# EAGLE design LCD_TFT_Breakout_1in8_128x160 (EAGLE 9.1.3)
DESIGNER: Owen Lyke
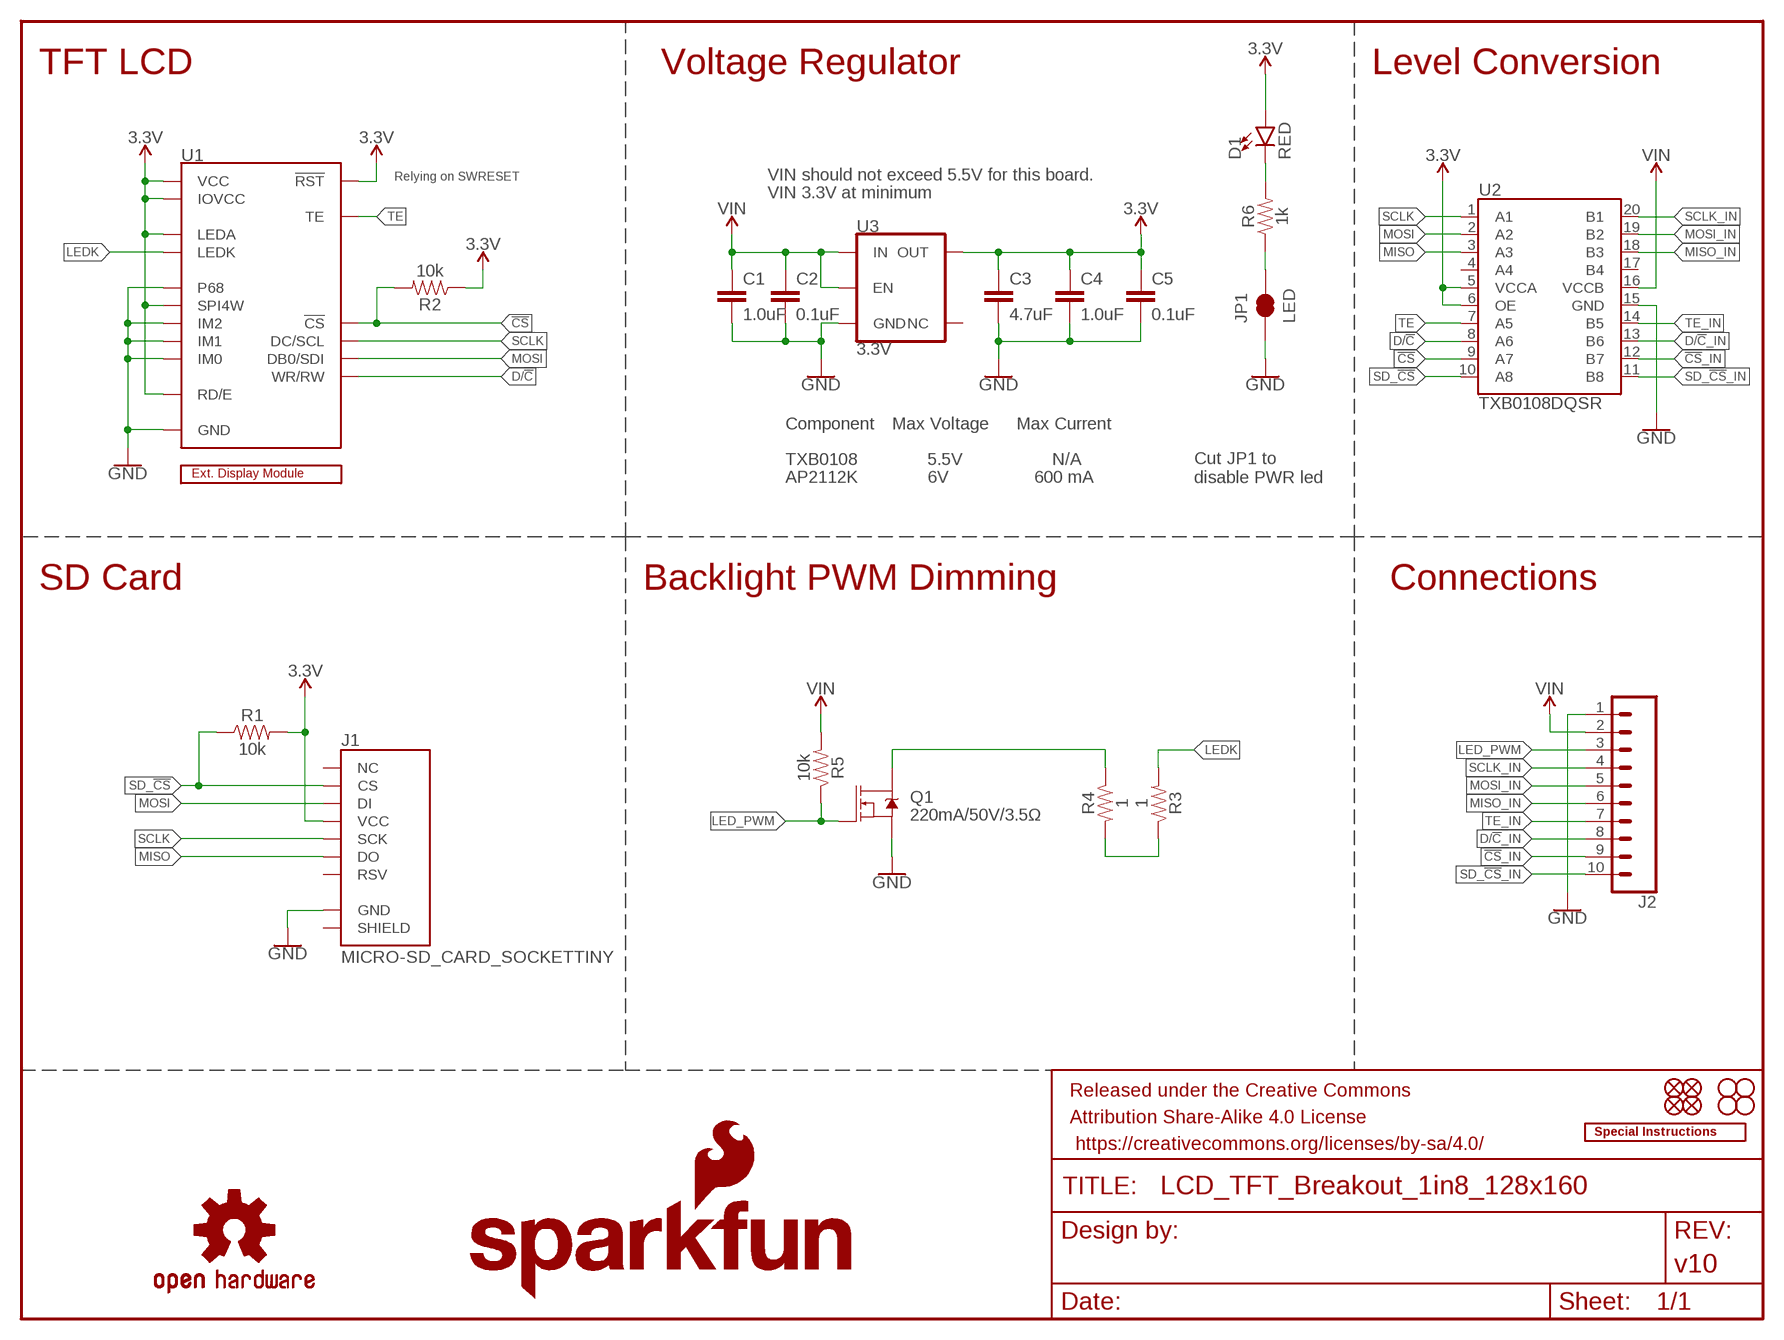
[diagram p0: schematic, sheet 1]

## Parts
C1  1.0uF  1.0UF-0603-16V-10%  [0603]
C2  0.1uF  0.1UF-0603-100V-10%  [0603]
C3  4.7uF  4.7UF-0603-6.3V-(10%)  [0603]
C4  1.0uF  1.0UF-0603-16V-10%  [0603]
C5  0.1uF  0.1UF-0603-100V-10%  [0603]
D1  RED  LED-RED0603  [LED-0603]
FD1  FIDUCIAL1X2  [FIDUCIAL-1X2]
FD2  FIDUCIAL1X2  [FIDUCIAL-1X2]
FD3  FIDUCIAL1X2  [FIDUCIAL-1X2]
FD4  FIDUCIAL1X2  [FIDUCIAL-1X2]
FRAME1  FRAME-LETTER  [CREATIVE_COMMONS]
H1  STAND-OFF  [STAND-OFF]
H2  STAND-OFF  [STAND-OFF]
H3  STAND-OFF  [STAND-OFF]
H4  STAND-OFF  [STAND-OFF]
J1  MICRO-SD_CARD_SOCKETTINY  [MICROSD_TINY]
J2  CONN_10NO_SILK_PTH_FEMALE  [1X10_NO_SILK]
JP1  LED  JUMPER-SMT_2_NC_TRACE_SILK  [SMT-JUMPER_2_NC_TRACE_SILK]
LOGO1  SFE_LOGO_NAME_FLAME.3_INCH  [SFE_LOGO_NAME_FLAME_.3]
LOGO2  SPECIAL_INSTRUCTIONS-PRODUCTION  [PRODUCTION_INSTRUCTIONS]
LOGO3  OSHW-LOGOS  [OSHW-LOGO-S]
Q1  220mA/50V/3.5Ω  MOSFET-NCH-BSS138  [SOT23-3]
R1  10k  10KOHM-0603-1/10W-1%  [0603]
R2  10k  10KOHM-0603-1/10W-1%  [0603]
R3  1  1OHM-0603-1/10W-1%  [0603]
R4  1  1OHM-0603-1/10W-1%  [0603]
R5  10k  10KOHM-0603-1/10W-1%  [0603]
R6  1k  1KOHM-0603-1/10W-1%  [0603]
U1  KWH018ST14-F01_4WSPI-BOTTOM  [FPC05040-17204]
U2  TXB0108DQSR  TXB0108  [UFDFN-20]
U3  3.3V  V_REG_AP2112K-3.3V  [SOT23-5]
U$33  EXTERNAL_DISP-KWH018ST14-F01  [KWH018ST14-F01_HOLES]

## Nets
3.3V: C3.1 C4.1 C5.1 D1.A J1.4(VCC) R1.2 R2.1 U1.P$1(LEDA) U1.P$4(!RST) U1.P$5(VCC) U1.P$6(IOVCC) U1.P$26(RD/E) U1.P$30(SPI4W) U2.5(VCCA) U2.6(OE) U3.5(OUT)
!CS: R2.2 U1.P$29(!CS) U2.9(A7)
!CS!_IN: J2.9 U2.12(B7)
D/!C: U1.P$27(WR/RW) U2.8(A6)
D/!C!_IN: J2.8 U2.13(B6)
GND: C1.2 C2.2 C3.2 C4.2 C5.2 J1.6(GND) J2.1 JP1.1 Q1.2(S) U1.P$3(GND) U1.P$8(GND) U1.P$9(GND) U1.P$10(GND) U1.P$11(GND) U1.P$12(GND) U1.P$13(GND) U1.P$14(GND) U1.P$15(GND) U1.P$16(GND) U1.P$17(GND) U1.P$18(GND) U1.P$19(GND) U1.P$20(GND) U1.P$21(GND) U1.P$22(GND) U1.P$23(GND) U1.P$24(GND) U1.P$31(P68) U1.P$32(IM2) U1.P$33(IM1) U1.P$34(IM0) U1.P$35(GND) U1.P$40(GND) U2.15(GND) U3.2(GND)
LED_PWM: J2.3 Q1.1(G) R5.1
LEDK: R3.2 U1.P$2(LEDK)
MISO: J1.7(DO) U2.3(A3)
MISO_IN: J2.6 U2.18(B3)
MOSI: J1.3(DI) U1.P$25(DB0/SDI) U2.2(A2)
MOSI_IN: J2.5 U2.19(B2)
N$1: D1.C R6.2
N$2: JP1.2 R6.1
N$3: R3.1 R4.2
N$5: Q1.3(D) R4.1
SCLK: J1.5(SCK) U1.P$28(DC/SCL) U2.1(A1)
SCLK_IN: J2.4 U2.20(B1)
SD_!CS: J1.2(CS) R1.1 U2.10(A8)
SD_!CS!_IN: J2.10 U2.11(B8)
TE: U1.P$7(TE) U2.7(A5)
TE_IN: J2.7 U2.14(B5)
VIN: C1.1 C2.1 J2.2 R5.2 U2.16(VCCB) U3.1(IN) U3.3(EN)
Unconnected: J1.1(RSV) J1.8(RSV) J1.9(NC) J1.GND1(SHIELD) J1.GND2(SHIELD) J1.GND3(SHIELD) J1.GND4(SHIELD) J1.GND5(SHIELD) J1.GND6(SHIELD) U2.4(A4) U2.17(B4) U3.4(NC)

## Notes on the sheet
- TFT LCD | Voltage Regulator | Level Conversion
- Relying on SWRESET | VIN should not exceed 5.5V for this board.
- VIN 3.3V at minimum
- Component | Max Voltage | Max Current
- TXB0108 | 5.5V | N/A
- AP2112K | 6V | 600 mA
- Cut JP1 to 
  disable PWR led
- SD Card | Backlight PWM Dimming | Connections

## Library data of the parts
C1 C4 = SparkFun-Capacitors:1.0UF: 1µF ceramic capacitors A capacitor is a passive two-terminal electrical component used to store electrical energy temporarily in an electric field.; PROD_ID: CAP-00868
C2 C5 = SparkFun-Capacitors:0.1UF: 0.1µF ceramic capacitors A capacitor is a passive two-terminal electrical component used to store electrical energy temporarily in an electric field.; PROD_ID: CAP-08390
C3 = SparkFun-Capacitors:4.7UF: 4.7µF ceramic capacitors A capacitor is a passive two-terminal electrical component used to store electrical energy temporarily in an electric field.; PROD_ID: CAP-08280
D1 = SparkFun-LED:LED-RED: Red SMD LED Used in manufacturing of most products at SparkFun Packages: 0603 - SMD 0603 package [Product Link] <http://docs.avagotech.com/docs/AV02-0551EN> 0603 SMART - SMD 0603 SMART package ( more efficient and expensive)[Product Link] <http://www.osram-os.com/Graphics/XPic2/00077099_0.pdf> 1206 - SMD1206 package [Product Link] <https://www.sparkfun.com/datasheets/DevTools/LilyPad/Q150OVS4.pdff> SparkFun Products: Pro Mini 328 -5V <https://www.sparkfun.com/products/821> RedBoard <https://www.sparkfun.com/products/12757> IOIO-OTG <https://www.sparkfun.com/products/13613>; PROD_ID: DIO-00819
FD1-FD4 = SparkFun-Aesthetics:FIDUCIAL: Fiducial Alignment Points Point-of-reference for pick-and-place machines and other optical instruments.
FRAME1 = SparkFun-Aesthetics:FRAME-LETTER: Schematic Frame - Letter Standard 8.5x11 US Letter frame; DESIGNER: Owen Lyke; REV: v10
H1-H4 = SparkFun-Hardware:STAND-OFF: Stand Off Drill holes for mechanically mounting via screws, standoffs, etc. Note: Use the keepout ring to avoid running the screw head into surrounding components. Variant Overviews STAND-OFF - Mechanical footprint for a #4 phillips button head screw. STAND-OFF-TIGHT - Mechanical footprint for a #4 phillips button head screw, Example SparkFun Products Screw - Phillips Head (1/4", 4-40, 10 pack) <https://www.sparkfun.com/products/10453> (PRT-10453) Screw - Phillips Head (1/2", 4-40, 10 pack) <https://www.sparkfun.com/products/10452> (PRT-10452) Screw - Phillips Head (3/4", 4-40, 10 pack) <https://www.sparkfun.com/products/10451> (PRT-10451) Screw - Phillips Head (1", 4-40, 10 pack) <https://www.sparkfun.com/products/10450> (PRT-10450)
J1 = SparkFun-Connectors:MICRO-SD_CARD_SOCKET: microSD Socket for Transflash Push-push type µSD socket. tDoc lines correctly indicate media card edge positions when inserting (unlocked, locked, depressed). NOTE: CD1 and CD2 are connected internally, and the default detect state of the socket is detect pin to ground. SparkFun Products: WAV Trigger <https://www.sparkfun.com/products/13660> CAN-Bus Shield <https://www.sparkfun.com/products/13262> SparkFun Level Shifing microSD Breakout <https://www.sparkfun.com/products/13743>; PROD_ID: CONN-13500
J2 = SparkFun-Connectors:CONN_10: Multi connection point. Often used as Generic Header-pin footprint for 0.1 inch spaced/style header connections On any of the 0.1 inch spaced packages, you can populate with these: Break Away Headers - Straight <https://www.sparkfun.com/products/116> (PRT-00116) Break Away Male Headers - Right Angle <https://www.sparkfun.com/products/553> (PRT-00553) Female Headers <https://www.sparkfun.com/products/115> (PRT-00115) Break Away Headers - Machine Pin <https://www.sparkfun.com/products/117> (PRT-00117) Break Away Female Headers - Swiss Machine Pin <https://www.sparkfun.com/products/743> (PRT-00743) Arduino Stackable Header - 10 Pin <https://www.sparkfun.com/products/11376> (PRT-11376) For SCREWTERMINALS and SPRING TERMINALS visit here: Screw Terimnals on SparkFun.com <https://www.sparkfun.com/search/results?term=Screw+Terminals> (5mm/3.5mm/2.54mm spacing) This device is also useful as a general connection point to wire up your design to another part of your project. Our various solder wires solder well into these plated through hole pads. Hook-Up Wire - Assortment (Stranded, 22 AWG) <https://www.sparkfun.com/products/11375> (PRT-11375) Hook-Up Wire - Assortment (Solid Core, 22 AWG) <https://www.sparkfun.com/products/11367> (PRT-11367) View the entire wire category on our website here <https://www.sparkfun.com/categories/141> Special notes: Molex polarized connector foot print use with SKU : PRT-08231 with associated crimp pins and housings. 1MM SMD Version SKU: PRT-10208 NOTES ON THE VARIANTS LOCK and LOCK_LONGPADS... This footprint was designed to help hold the alignment of a through-hole component (i.e. 6-pin header) while soldering it into place. You may notice that each hole has been shifted either up or down by 0.005 of an inch from it's more standard position (which is a perfectly straight line). This slight alteration caused the pins (the squares in the middle) to touch the edges of the holes. Because they are alternating, it causes a "brace" to hold the component in place. 0.005 has proven to be the perfect amount of "off-center" position when using our standard breakaway headers. Although looks a little odd when you look at the bare footprint, once you have a header in there, the alteration is very hard to notice. Also,if you push a header all the way into place, it is covered up entirely on the bottom side.; PROD_ID: CONN-11563
JP1 = SparkFun-Jumpers:JUMPER-SMT_2_NC_TRACE: Normally closed trace jumper This jumper has a trace between two pads so it's normally closed (NC). Use a razor knife to open the connection. For best results follow the IPC guidelines for cutting traces: Cutout at least 0.063 mm (0.005 in). Remove all loose material to clean up the cut area. Seal the cut with an approved epoxy. Reapply solder to reclose the connection.
LOGO1 = SparkFun-Aesthetics:SFE_LOGO_NAME_FLAME: SparkFun Font Logo w/ Flame This is the SparkFun full logo. The logo on the schematic will always be the same size; the package variant is the height of the flame part of the logo. Default layer for the logo on the board is tSilk.
LOGO2 = SparkFun-Aesthetics:SPECIAL_INSTRUCTIONS: Special Ordering/Production Instructions Alert Symbol for special PCB ordering instructions or unique production process warnings. Ordering Instructions Production Instructions Types of information that should be added to box: Copper weight Soldermask color Silk color PCB thickness Number of layers PCB Standard: 1.6mm FR4 1 oz copper immersion silver plating red soldermask white silkscreen Types of information that should be added to box: Special wash requirements Depaneling instructions Humidification Glue curing Default text settings: 0.07 inch 9% ratio 50% line distance
LOGO3 = SparkFun-Aesthetics:OSHW-LOGO: Open-Source Hardware (OSHW) Logo This logo indicates the piece of hardware it is found on incorporates a OSHW license and/or adheres to the definition of open source hardware found here: http://freedomdefined.org/OSHW
Q1 = SparkFun-DiscreteSemi:MOSFET-NCH: N-channel MOSFETs Voltage controlled devices that allow control of high current outputs. SparkFun Products: SparkFun OpenScale <https://www.sparkfun.com/products/13261> SparkFun Digital Sandbox <https://www.sparkfun.com/products/12651> SparkFun Monster Moto Shield <https://www.sparkfun.com/products/10182> SparkFun MOSFET Power Controller <https://www.sparkfun.com/products/11214>; PROD_ID: TRANS-00830
R1 R2 R5 = SparkFun-Resistors:10KOHM: 10kΩ resistor A resistor is a passive two-terminal electrical component that implements electrical resistance as a circuit element. Resistors act to reduce current flow, and, at the same time, act to lower voltage levels within circuits. - Wikipedia; PROD_ID: RES-00824
R3 R4 = SparkFun-Resistors:1OHM: 1Ω resistor A resistor is a passive two-terminal electrical component that implements electrical resistance as a circuit element. Resistors act to reduce current flow, and, at the same time, act to lower voltage levels within circuits. - Wikipedia; PROD_ID: RES-08269
R6 = SparkFun-Resistors:1KOHM: 1kΩ resistor A resistor is a passive two-terminal electrical component that implements electrical resistance as a circuit element. Resistors act to reduce current flow, and, at the same time, act to lower voltage levels within circuits. - Wikipedia; PROD_ID: RES-07856
U1 = SparkFun-Displays:KWH018ST14-F01_4WSPI: Fomike KWH018ST14-F01 TFT LCD Module Using 4WSPI Interface 128 x 160 pixel 18-bit color depth LCD module with LED backlight. This part uses the 4WSPI interface, though several other interface options are broken out in the FPC cable. Use the other corresponding devices for 3WSPI, and 8/9/16/18 bit parallel. Note: PROD_ID corresponds to the connector and the second ID (PROD_ID1 = LCD-14196) corresponds to the actual module Variants: Bottom - For use with bottom-contact FPC connectors Top - For use with top-contact FPC connectors SparkFun Products:; PROD_ID: CONN-14082; PROD_ID1: LCD-14196
U2 = SparkFun-IC-Comms:TXB0108: 8-Bit Bi-Directional Level Shifter 1.2V-3.6V (VCCA) to 1.65V-5.5V (VCCB) bi-directional level shifter with auto direction sensing. Max data rate - VCCA 1.2V: 20Mbps (50ns), VCCA 3.3V: 100Mbps (10ns) Digikey: 296-27217-1-ND (20-UFDFN) SparkFun Products SparkFun GPS Logger Shield <https://www.sparkfun.com/products/13750> (GPS-13750) SparkFun Block for Intel® Edison - microSD <https://www.sparkfun.com/products/13041> (DEV-13041) SparkFun Block for Intel® Edison - Dual H-Bridge <https://www.sparkfun.com/products/13043> (DEV-13043) SparkFun Block for Intel® Edison - GPIO <https://www.sparkfun.com/products/13038> (DEV-13038) SparkFun Block for Intel® Edison - Raspberry Pi B <https://www.sparkfun.com/products/13044> (DEV-13044); PROD_ID: IC-12292
U3 = SparkFun-IC-Power:V_REG_AP2112: AP2112 - 600mA CMOS LDO Regulator w/ Enable The AP2112 is CMOS process low dropout linear regulator with enable function, the regulator delivers a guaranteed 600mA (min.) continuous load current. Features Output Voltage Accuracy: ±1.5% Output Current: 600mA (Min.) Foldback Short Current Protection: 50mA Enable Function to Turn ON/OFF VOUT Low Dropout Voltage (3.3V): 250mV (Typ.) @IOUT=600mA Excellent Load Regulation: 0.2%/A (Typ.) Excellent Line Regulation: 0.02%/V (Typ.) Low Quiescent Current: 55μA (Typ.) Low Standby Current: 0.01μA (Typ.) Low Output Noise: 50μVRMS PSRR: 100Hz -65dB, 1kHz -65dB OTSD Protection Stable with 1.0μF Flexible Cap: Ceramic, Tantalum and Aluminum Electrolytic Operation Temperature Range: -40°C to 85°C ESD: MM 400V, HBM 4000V; PROD_ID: VREG-12457
U$33 = SparkFun-Displays:EXTERNAL_DISP: External Display Device Use this device to represent a display module that you connect to your board with a connector. (The connector will be electrically linked to the symbol for your display and connected to traces) Using this along with a footprint of the display module outline will allow the BOM utility to find the correct PROD_ID for the module. Then you can move it to the BOM list (it will be in non-BOM list unless it has a hardware element like holes or pads) Variants: KWH018ST14-F01A footprint of the KWH018ST14-F01 with holes SparkFun Products:; PROD_ID: LCD-14196

## Board
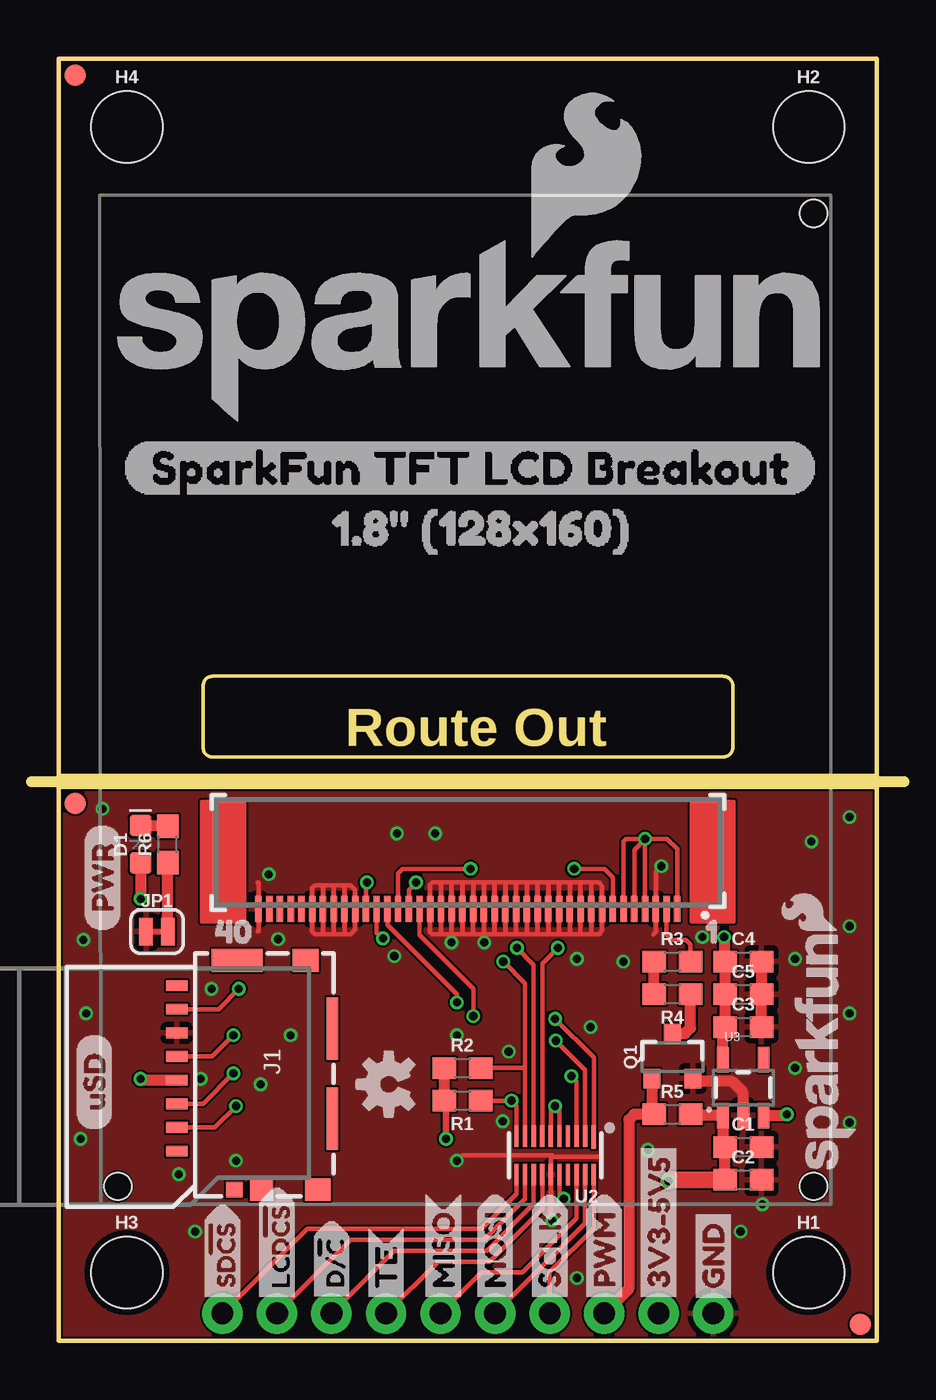
[diagram p1: board, top side]
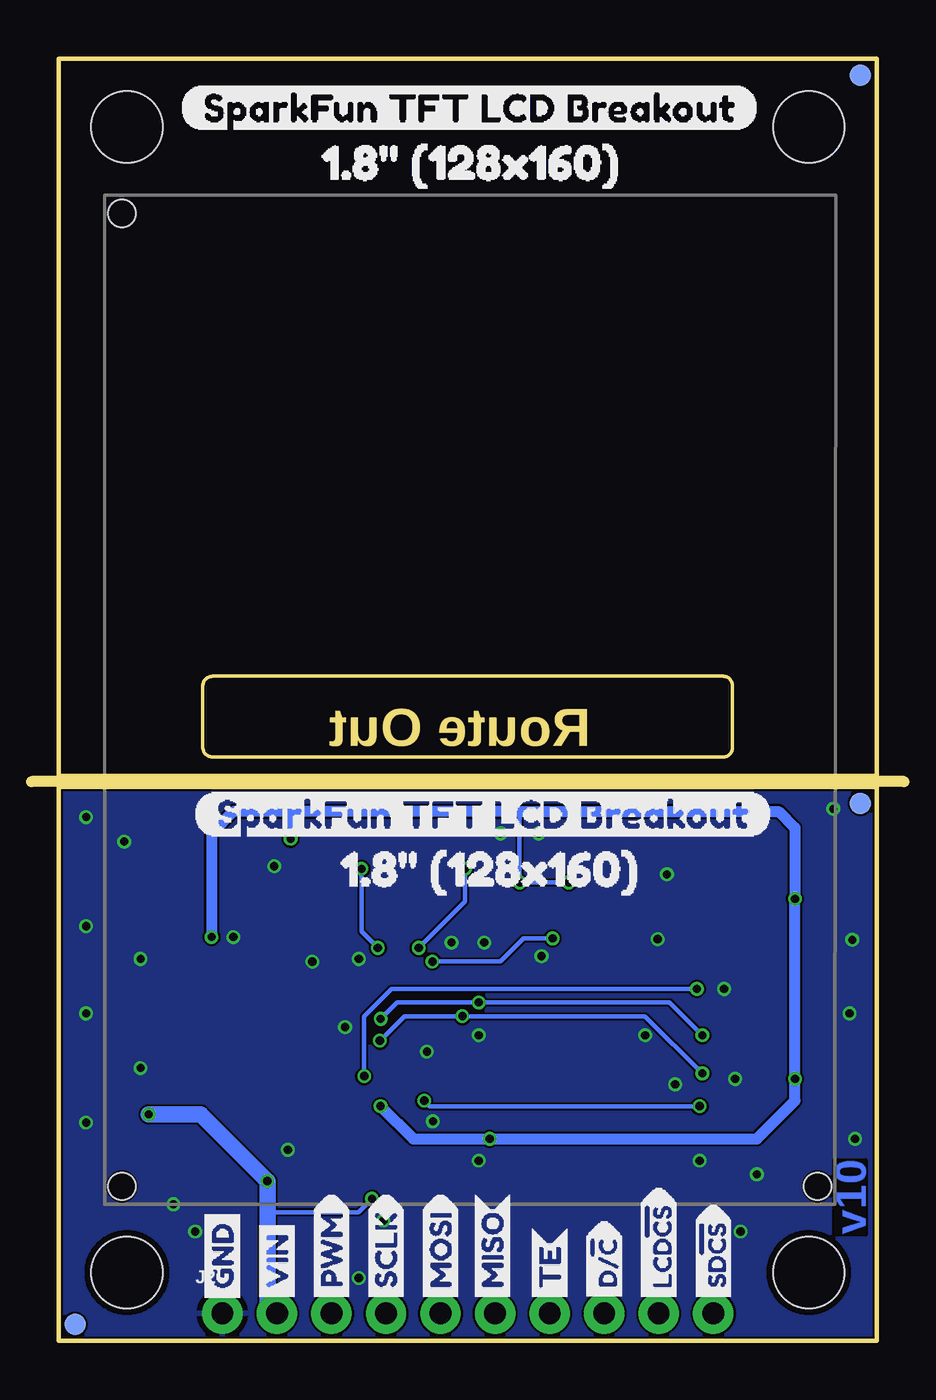
[diagram p2: board, bottom side, seen from below]

Size 38.1 x 59.69 mm. Coordinates in mm from the lower left corner, seen from the top.
Outline: 38.1,0 0,0 0,25.78 38.1,25.78 38.1,0
Outline: 0,59.69 38.1,59.69 38.1,26.29 0,26.29 0,59.69
Outline: 30.94,30.94 arc-90 31.4,30.48 31.4,27.65 arc-90 30.93,27.18 7.15,27.18 arc-90 6.73,27.6 6.73,30.51 arc-90 7.16,30.94 30.94,30.94
Copper layers (1*16): Top 0.035mm / dielectric 1.5mm / Bottom 0.035mm
Design rules "SparkFun-2-layer-FAB-LIMIT": minimum track width 4mil, minimum drill 6mil, track to track 4mil, track to pad 4mil, pad to pad 4mil, via to via 4mil, smd to smd 4mil, copper to edge 4mil, drill to drill 4mil, minimum pad ring 5mil, minimum via ring 5mil, stop-mask expansion 4mil, vias tented up to drill 25mil, thermal gap 10mil
Milling: 1 lines

### Footprints (pad centres in the part's own frame; a part is rotated, then mirrored left to right if it is on the bottom)
0603 = smd 1.1 x 1: 1 -0.85,0; 2 0.85,0
LED-0603 = smd 1 x 1: A -0.877,0; C 0.877,0
FIDUCIAL-1X2 = smd 1 x 1: 1 0,0
STAND-OFF = hole 3.302: 0,0
MICROSD_TINY = smd 0.5 x 1: 1 9.2,-0.85; 2 8.1,-0.85; 3 7,-0.85; 4 5.9,-0.85; 5 4.8,-0.85; 6 3.7,-0.85; 7 2.6,-0.85; 8 1.5,-0.85 | smd 0.72 x 0.78: 9 11,1.83 | smd 1.05 x 1.08: GND1 11,3.1 | smd 1.05 x 1.2: GND2 11,5.71; GND3 0.325,5.14 | smd 1.05 x 2.39: GND4 0.325,1.955 | smd 2.91 x 0.55: GND5 3.505,6.385; GND6 7.695,6.385
1X10_NO_SILK = drill 1.016 pad 1.88: 1 0,0; 2 2.54,0; 3 5.08,0; 4 7.62,0; 5 10.16,0; 6 12.7,0; 7 15.24,0; 8 17.78,0; 9 20.32,0; 10 22.86,0
SMT-JUMPER_2_NC_TRACE_SILK = smd 0.635 x 1.27: 1 -0.508,0; 2 0.508,0
SOT23-3 = smd 0.8 x 0.9: 1 -0.95,-1; 2 0.95,-1; 3 0,1.1
FPC05040-17204 = smd 0.3 x 1.2: P$1 -9.75,0.6; P$2 -9.25,0.6; P$3 -8.75,0.6; P$4 -8.25,0.6; P$5 -7.75,0.6; P$6 -7.25,0.6; P$7 -6.75,0.6; P$8 -6.25,0.6; P$9 -5.75,0.6; P$10 -5.25,0.6; P$11 -4.75,0.6; P$12 -4.25,0.6; P$13 -3.75,0.6; P$14 -3.25,0.6; P$15 -2.75,0.6; P$16 -2.25,0.6; P$17 -1.75,0.6; P$18 -1.25,0.6; P$19 -0.75,0.6; P$20 -0.25,0.6; P$21 0.25,0.6; P$22 0.75,0.6; P$23 1.25,0.6; P$24 1.75,0.6; P$25 2.25,0.6; P$26 2.75,0.6; P$27 3.25,0.6; P$28 3.75,0.6; P$29 4.25,0.6; P$30 4.75,0.6; P$31 5.25,0.6; P$32 5.75,0.6; P$33 6.25,0.6; P$34 6.75,0.6; P$35 7.25,0.6; P$36 7.75,0.6; P$37 8.25,0.6; P$38 8.75,0.6; P$39 9.25,0.6; P$40 9.75,0.6
UFDFN-20 = smd 0.2 x 1.1: 1 -1.8,-0.85 | smd 0.2 x 1: 2 -1.4,-0.9; 3 -1,-0.9; 4 -0.6,-0.9; 5 -0.2,-0.9; 6 0.2,-0.9; 7 0.6,-0.9; 8 1,-0.9; 9 1.4,-0.9; 10 1.8,-0.9; 11 1.8,0.9; 12 1.4,0.9; 13 1,0.9; 14 0.6,0.9; 15 0.2,0.9; 16 -0.2,0.9; 17 -0.6,0.9; 18 -1,0.9; 19 -1.4,0.9; 20 -1.8,0.9
SOT23-5 = smd 0.55 x 1.2: 1 -0.95,-1.3; 2 0,-1.3; 3 0.95,-1.3; 4 0.95,1.3; 5 -0.95,1.3
KWH018ST14-F01_HOLES = hole 1.27: -33.25,-0.85; -33.25,-46.15; -0.85,-46.15

### Placement (x,y rotation side)
C1  31.88,9.02 0 top
C2  31.88,7.49 0 top
C3  31.88,14.61 0 top
C4  31.88,17.65 0 top
C5  31.88,16.13 0 top
D1  3.81,23.11 90 top
FD1  0.76,58.93 0 top
FD2  37.34,0.76 0 top
FD3  0.76,58.93 0 bottom
FD4  37.34,0.76 0 bottom
FD5  FIDUCIAL1X2  [FIDUCIAL-1X2]  0.76,25.02 0 top
FD6  FIDUCIAL1X2  [FIDUCIAL-1X2]  0.76,25.02 0 bottom
FRAME1  0,-23.11 0 top  (outside the outline)
H1  34.92,3.17 0 top
H2  34.92,56.52 0 top
H3  3.17,3.17 0 top
H4  3.17,56.52 0 top
J1  6.35,18.03 270 top
J2  30.48,1.27 0 bottom
JP1  4.57,19.05 0 top
LOGO1  19.05,46.99 0 top
LOGO2  -24.51,-40.39 0 top  (outside the outline)
LOGO3  15.37,11.94 90 top
Q1  28.57,13.21 0 top
R1  18.8,11.18 180 top
R2  18.8,12.7 0 top
R3  28.57,17.65 0 top
R4  28.57,16.13 180 top
R5  28.57,10.54 0 top
R6  5.08,23.11 90 top
U1  19.05,20.7 180 top
U2  23.11,8.64 180 top
U3  31.88,11.79 0 top
U$1  [3V3#5V50]  27.94,1.52 90 top
U$2  [SFE_LOGO_NAME_.1]  35.69,13.46 90 top
U$3  [SFE_LOGO_FLAME_.1]  34.92,19.94 90 top
U$4  [USD2]  1.65,9.78 90 top
U$5  [LCD#CS1]  10.16,1.4 90 top
U$6  [LCD#CS1]  10.16,1.4 90 bottom
U$7  [D##C7]  12.7,1.4 90 bottom
U$8  [SD#CS0]  7.62,1.4 90 top
U$9  [GND0]  30.48,1.52 90 bottom
U$10  [VIN1]  27.94,1.52 90 bottom
U$11  [MISO3]  17.91,1.52 90 bottom
U$12  [MOSI2]  20.32,1.52 90 bottom
U$13  [SCLK4]  22.86,1.52 90 bottom
U$14  [TE5]  15.24,1.52 90 bottom
U$15  [PWM6]  25.4,1.52 90 bottom
U$16  [SD#CS0]  7.62,1.4 90 bottom
U$17  [10]  29.21,19.05 0 top
U$18  [PWR4]  2.03,19.05 90 top
U$19  [SPARKFUN_TFT_LCD_BREAKOUT1]  2.92,40.64 0 top
U$20  [1#8#_#128X160#1]  11.4,37.85 0 top
U$21  [SPARKFUN_TFT_LCD_BREAKOUT2]  32.51,57.4 0 bottom
U$22  [1#8#_#128X160#0]  27.18,54.86 0 bottom
U$23  [SPARKFUN_TFT_LCD_BREAKOUT2]  31.88,24.51 0 bottom
U$24  [1#8#_#128X160#0]  26.29,21.97 0 bottom
U$25  [D##C7]  12.7,1.4 90 top
U$26  [MISO3]  17.91,1.52 90 top
U$27  [MOSI2]  20.32,1.52 90 top
U$28  [SCLK4]  22.86,1.52 90 top
U$29  [TE5]  15.24,1.52 90 top
U$30  [PWM6]  25.4,1.52 90 top
U$31  [401]  6.35,19.05 0 top
U$32  [GND0]  30.48,1.52 90 top
U$33  1.91,53.34 0 bottom

### Tracks (layer width: path | path; a pad name or v marks a point on that pad's centre or on a via)
3.3V  (via drill 0.38)
  Top 0.203: U2.6 22.91,10.72 v23.11,10.92 23.31,10.72 U2.5 | U1.P$4 v27.3,23.36 | v27.3,23.36 v27.3,23.37 | U1.P$5 26.8,22.86 v27.3,23.36 | U1.P$6 26.3,23.25 26.42,23.37 v27.3,23.37 v27.3,23.36 | U1.P$1 28.8,22.89 28.33,23.36 v27.3,23.36 | U1.P$26 16.3,21 v16.64,21.34 | U1.P$30 14.3,21.29 v14.35,21.34
  Top 0.305: v18.03,9.4 18.03,11.09 R1.2
  Top 0.508: U3.5 30.93,14.51 C3.1 C5.1 C4.1 30.99,17.69 v30.99,18.8 | R2.1 R1.2 | D1.A v3.81,20.57 | J1.4 3.87,12.13 v3.81,12.19
  Bottom 0.203: 16.64,24.64 v16.64,21.34 v14.35,21.34
  Bottom 0.508: v23.11,10.92 21.59,9.4 v18.03,9.4 5.59,9.4 3.81,11.18 v3.81,12.19 v3.81,20.57 3.81,23.88 4.57,24.64 16.64,24.64 27.3,24.64 | 27.3,24.64 29.97,24.64 30.99,23.62 v30.99,18.8 | v27.3,23.37 27.3,24.64
!CS  (via drill 0.38)
  Top 0.203: U1.P$29 14.8,18.99 15.06,18.73 v15.1,18.73 | U2.9 21.71,12.7 | 21.71,12.7 21.71,16.64 v20.7,17.65 | R2.2 21.71,12.7
  Bottom 0.203: v20.7,17.65 17.53,17.65 16.45,18.73 v15.1,18.73
!CS!_IN
  Top 0.203: U2.12 21.71,6.6 19.81,4.7 13.59,4.7 J2.9
D/!C  (via drill 0.38)
  Top 0.203: U2.8 22.11,17.51 v21.34,18.29 | v19.18,21.97 16,21.97 15.8,21.77 U1.P$27
  Bottom 0.203: v19.18,21.97 19.18,20.45 v21.34,18.29
D/!C!_IN
  Top 0.203: J2.8 15.62,4.19 19.94,4.19 22.11,6.37 U2.13
GND  (via drill 0.38)
  Top 0.203: 9.27,21.34 9.3,21.31 U1.P$40 9.3,19.08 9.27,19.05 | 12.32,21.21 11.94,21.21 11.8,21.07 U1.P$35 11.8,19.06 11.94,18.92 12.32,18.92 | 12.32,21.21 12.83,21.21 | 12.83,21.21 13.21,21.21 | 13.21,21.21 13.59,21.21 13.8,21 U1.P$31 13.8,19.13 13.59,18.92 13.34,18.92 | 12.32,21.21 12.3,21.19 U1.P$34 12.3,18.94 12.32,18.92 | v22.99,5.59 22.91,5.66 U2.15 22.91,8.56 | 22.91,8.56 22.99,8.64 18.8,8.64 v18.54,8.38 | 22.91,8.56 25.2,8.56 25.27,8.64 | 12.32,18.92 12.83,18.92 | 12.83,18.92 13.34,18.92 | 17.78,21.34 17.4,21.34 17.3,21.24 U1.P$24 17.3,19.02 17.4,18.92 17.78,18.92 | 17.78,21.34 18.29,21.34 | 18.29,21.34 18.8,21.34 | 18.8,21.34 19.3,21.34 | 19.3,21.34 19.81,21.34 | 19.81,21.34 20.32,21.34 | 20.32,21.34 20.83,21.34 | 20.83,21.34 21.21,21.34 | 21.21,21.34 21.84,21.34 | 21.84,21.34 22.23,21.34 | 22.23,21.34 22.73,21.34 | 22.73,21.34 23.24,21.34 | 23.24,21.34 23.75,21.34 | 23.75,21.34 24.26,21.34 | 24.26,21.34 24.77,21.34 | 24.77,21.34 25.15,21.34 25.3,21.18 U1.P$8 25.3,19.08 25.15,18.92 24.77,18.92 | 17.78,18.92 18.29,18.92 | 18.29,18.92 18.8,18.92 | 18.8,18.92 19.3,18.92 | 19.3,18.92 19.81,18.92 | 19.81,18.92 20.32,18.92 | 20.32,18.92 20.83,18.92 | 20.83,18.92 21.34,18.92 | 21.34,18.92 21.84,18.92 | 21.84,18.92 22.35,18.92 | 22.35,18.92 22.86,18.92 | 22.86,18.92 23.37,18.92 | 23.37,18.92 23.88,18.92 | 23.88,18.92 24.26,18.92 | 24.26,18.92 24.77,18.92 | 24.77,18.92 24.8,18.96 U1.P$9 24.8,21.3 24.77,21.34 | 24.26,21.34 24.3,21.29 U1.P$10 24.3,18.97 24.26,18.92 | 23.75,21.34 23.8,21.29 U1.P$11 23.8,19 23.88,18.92 | 23.24,21.34 23.3,21.28 U1.P$12 23.3,18.99 23.37,18.92 | 22.73,21.34 22.8,21.27 U1.P$13 22.8,18.98 22.86,18.92
  Top 0.203: 22.23,21.34 22.3,21.26 U1.P$14 22.3,18.98 22.35,18.92 | 21.84,21.34 21.8,21.29 U1.P$15 21.8,18.97 21.84,18.92 | 21.21,21.34 21.3,21.25 U1.P$16 21.3,18.96 21.34,18.92 | 20.83,21.34 20.8,21.31 U1.P$17 20.8,18.95 20.83,18.92 | 20.32,21.34 20.3,21.32 U1.P$18 20.3,18.94 20.32,18.92 | 19.81,21.34 19.8,21.32 U1.P$19 19.8,18.93 19.81,18.92 | 19.3,21.34 U1.P$20 19.3,18.93 19.3,18.92 | 18.8,21.34 18.8,21.33 U1.P$21 18.8,18.93 18.8,18.92 | 18.29,21.34 18.3,21.32 U1.P$22 18.3,18.93 18.29,18.92 | 17.78,21.34 17.8,21.32 U1.P$23 17.8,18.94 17.78,18.92 | 27.69,18.92 27.8,19.04 U1.P$3 27.8,21.83 v28.07,22.1 | 13.21,21.21 13.3,21.12 U1.P$32 13.3,18.96 13.34,18.92 | 12.83,18.92 12.8,18.95 U1.P$33 12.8,21.18 12.83,21.21
  Top 0.508: U3.2 31.88,11.56 31.37,12.06 29.67,12.06 Q1.2 | C3.2 C5.2 C4.2
  other vias: 2.03,24.77 1.14,18.67 1.27,15.24 1.02,9.4 6.35,5.08 8.26,8.38 35.05,23.24 36.83,24.38 36.83,19.3 34.29,17.78 36.83,15.24 36.83,10.16 34.29,12.7 31.75,5.08 24.13,17.78 18.29,18.54 19.81,18.54 15.62,17.91 24.13,2.92 27.43,8.89 17.53,23.62 15.75,23.62 32.77,6.35 10.79,14.22 18.54,14.22 9.78,21.72 26.29,17.65 7.11,16.38 29.97,18.8 10.21,18.69 5.59,7.75 24.77,14.61 9.4,11.94 20.95,13.46 20.68,10.21 6.6,12.19
  pour Top (isolate 0.025): 0,0 38.1,0 38.1,26.29 0,26.29
  pour Bottom (isolate 0.025): 0,0 0,26.29 38.1,26.29 38.1,0
LED_PWM
  Top 0.508: Q1.1 27.62,10.64 R5.1 26.8,10.54 26.54,10.29 26.54,2.41 J2.3
LEDK
  Top 0.203: U1.P$2 28.3,18.92 28.55,18.67 29.21,18.67 29.43,18.45 R3.2
MISO  (via drill 0.38)
  Top 0.203: U2.3 24.11,12.08 v23.87,12.32 | J1.7 7.43,15.43 v8.38,16.38
  Bottom 0.203: v8.38,16.38 22.6,16.38 23.87,15.11 v23.87,12.32
MISO_IN
  Top 0.203: J2.6 19.68,3.17 21.59,3.17 24.11,5.7 U2.18
MOSI  (via drill 0.38)
  Top 0.203: U2.2 24.51,12.61 v23.15,13.97 | U1.P$25 16.8,18.89 19.3,16.38 v19.3,15.11 | J1.3 6.72,11.03 v8.13,12.45
  Bottom 0.203: v23.15,13.97 22.01,15.11 v19.3,15.11 10.79,15.11 v8.13,12.45
MOSI_IN
  Top 0.203: J2.5 24.51,5.46 U2.19
N$1
  Top 0.508: D1.C 5.05,23.99 R6.2
N$2
  Top 0.508: JP1.2 R6.1
N$3
  Top 0.508: R4.2 R3.1
N$5
  Top 0.508: Q1.3 29.17,14.31 29.43,14.57 R4.1
SCLK  (via drill 0.38)
  Top 0.203: U2.1 24.91,13.18 v23.11,14.99 | U1.P$28 15.3,19.37 18.54,16.13 v18.54,15.75 | J1.5 7.14,13.23 v8.13,14.22
  Bottom 0.203: v23.11,14.99 22.35,15.75 v18.54,15.75 9.65,15.75 v8.13,14.22
SCLK_IN
  Top 0.203: J2.4 22.86,3.17 24.91,5.23 U2.20
SD_!CS  (via drill 0.38)
  Top 0.203: U2.10 21.31,10.94 v21.08,11.18 R1.1 | J1.2 7.27,9.93 v8.26,10.92
  Bottom 0.203: v8.26,10.92 20.83,10.92 v21.08,11.18
SD_!CS!_IN
  Top 0.203: J2.10 11.56,5.21 19.68,5.21 21.31,6.84 U2.11
TE  (via drill 0.38)
  Top 0.203: U2.7 22.51,17.56 v23.24,18.29 | v24,21.97 25.4,21.97 25.8,21.57 U1.P$7
  Bottom 0.203: v24,21.97 24,19.05 v23.24,18.29
TE_IN
  Top 0.203: J2.7 17.65,3.68 20.07,3.68 22.51,6.13 U2.14
VIN  (via drill 0.38)
  Top 0.203: U2.16 23.31,6.81 v23.52,6.6
  Top 0.508: C2.1 C1.1 30.93,9.12 U3.1 29.48,10.49 R5.2 | U3.3 33.85,10.49 v33.91,10.54
  Top 0.762: C2.1 28.45,7.49 v28.38,7.43
  Bottom 0.203: v23.52,6.6 24.14,5.98 28.38,5.98
  Bottom 0.762: v33.91,10.54 31.5,10.54 v28.38,7.43 28.38,5.98 28.38,1.71 J2.2

### Text on the board
Bottom: v10
Dimension: Route Out
Measures: IN | IN | IN | IN
tDocu: Owen Lyke | When panelizing please extend the mid-board v-score lines across / the panel without changing location. This is a break-away option / for the user